# EAGLE design UD27C (EAGLE 6.4)
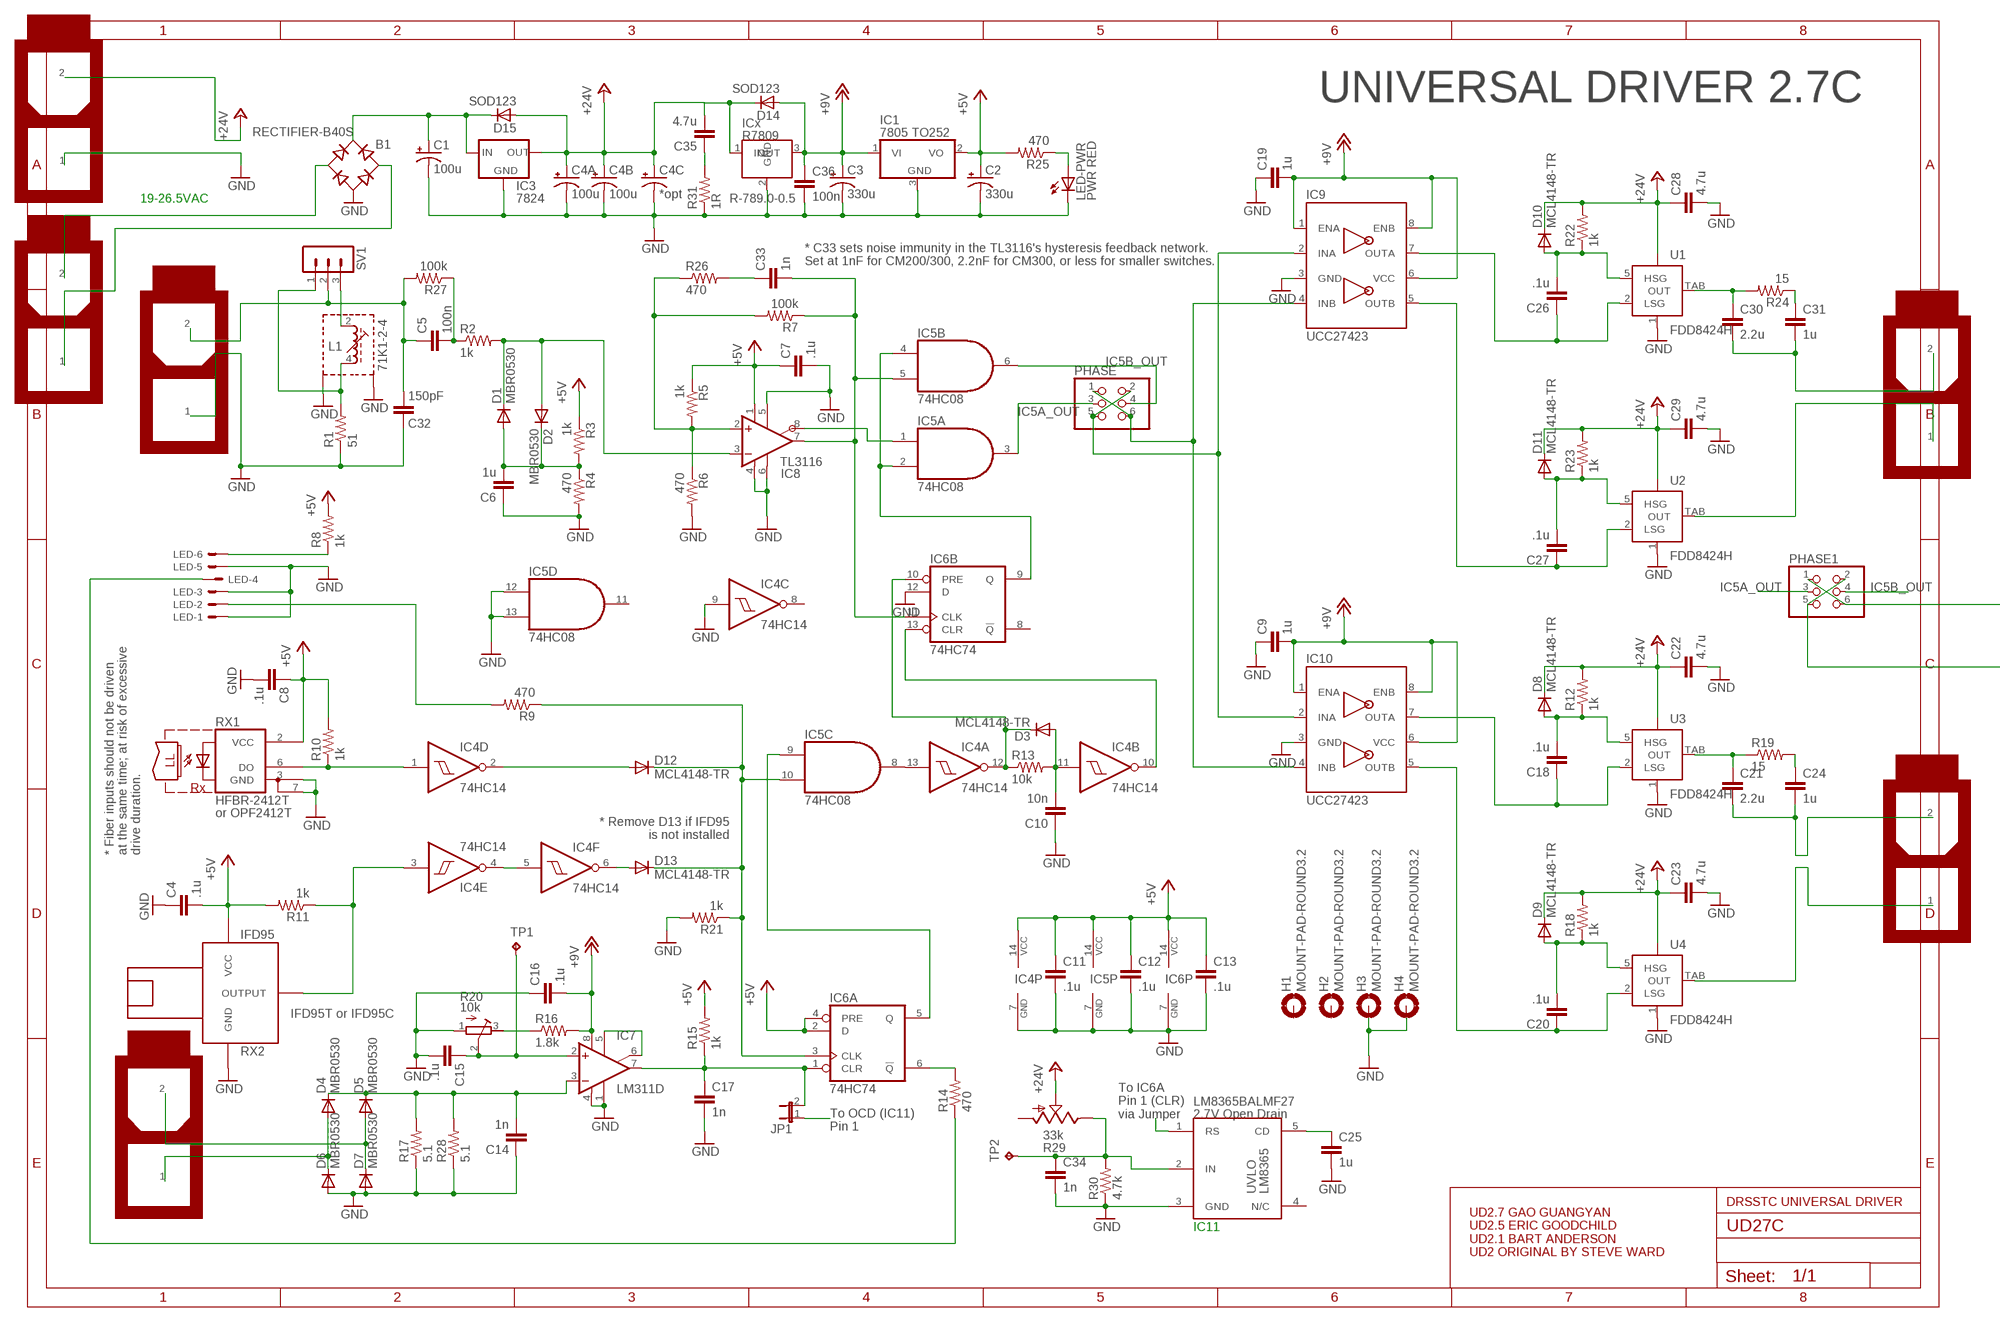
[diagram p0: schematic, sheet 1, part 1 of 2]
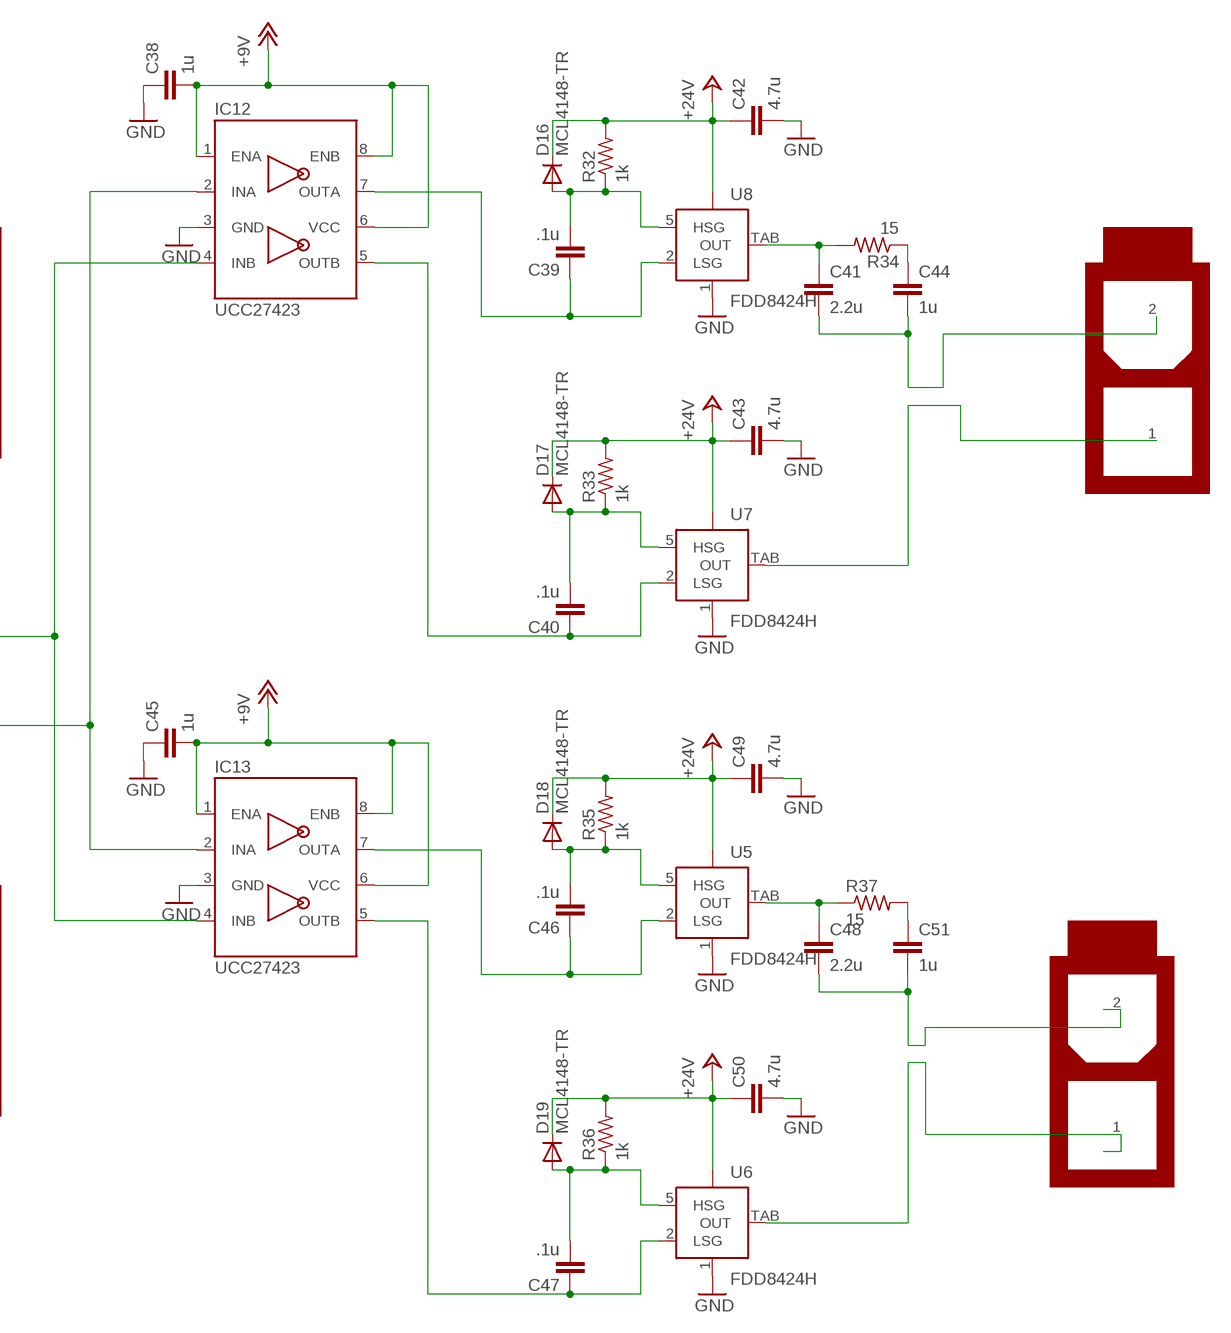
[diagram p1: schematic, sheet 1, part 2 of 2]

## Parts
B1  RECTIFIER-B40S  [B40S]
C1  100u  CPOL-USE3.5-8  [E3,5-8]
C2  330u  CPOL-USE3.5-8  [E3,5-8]
C3  330u  CPOL-USE3.5-8  [E3,5-8]
C4  .1u  C-EUC0805  [C0805]
C4A  100u  CPOL-USE3.5-8  [E3,5-8]
C4B  100u  CPOL-USE3.5-8  [E3,5-8]
C4C  *opt  CPOL-USE3.5-8  [E3,5-8]
C5  100n  C-EUC0805  [C0805]
C6  1u  C-EUC0805  [C0805]
C7  .1u  C-EUC0805  [C0805]
C8  .1u  C-EUC0805  [C0805]
C9  1u  C-EUC0805  [C0805]
C10  10n  C-EUC0805  [C0805]
C11  .1u  C-EUC0805  [C0805]
C12  .1u  C-EUC0805  [C0805]
C13  .1u  C-EUC0805  [C0805]
C14  1n  C-EUC0805  [C0805]
C15  .1u  C-EUC0805  [C0805]
C16  .1u  C-EUC0805  [C0805]
C17  1n  C-EUC0805  [C0805]
C18  .1u  C-EUC0805  [C0805]
C19  1u  C-EUC0805  [C0805]
C20  .1u  C-EUC0805  [C0805]
C21  2.2u  C-EUC1210  [C1210]
C22  4.7u  C-EUC1206  [C1206]
C23  4.7u  C-EUC1206  [C1206]
C24  1u  C-EUC1206  [C1206]
C25  1u  C-EUC0805  [C0805]
C26  .1u  C-EUC0805  [C0805]
C27  .1u  C-EUC0805  [C0805]
C28  4.7u  C-EUC1206  [C1206]
C29  4.7u  C-EUC1206  [C1206]
C30  2.2u  C-EUC1210  [C1210]
C31  1u  C-EUC1206  [C1206]
C32  150pF  C-EUC0805  [C0805]
C33  1n  C-EUC1206  [C1206]
C34  1n  C-EUC0805  [C0805]
C35  4.7u  C-EUC1206K  [C1206K]
C36  100n  C-EUC0805  [C0805]
C38  1u  C-EUC0805  [C0805]
C39  .1u  C-EUC0805  [C0805]
C40  .1u  C-EUC0805  [C0805]
C41  2.2u  C-EUC1210  [C1210]
C42  4.7u  C-EUC1206  [C1206]
C43  4.7u  C-EUC1206  [C1206]
C44  1u  C-EUC1206  [C1206]
C45  1u  C-EUC0805  [C0805]
C46  .1u  C-EUC0805  [C0805]
C47  .1u  C-EUC0805  [C0805]
C48  2.2u  C-EUC1210  [C1210]
C49  4.7u  C-EUC1206  [C1206]
C50  4.7u  C-EUC1206  [C1206]
C51  1u  C-EUC1206  [C1206]
D1  MBR0530  1N4148  [SOD323-W]
D2  MBR0530  1N4148  [SOD323-W]
D3  MCL4148-TR  1N4148  [SOD323-W]
D4  MBR0530  1N4148  [SOD323-W]
D5  MBR0530  1N4148  [SOD323-W]
D6  MBR0530  1N4148  [SOD323-W]
D7  MBR0530  1N4148  [SOD323-W]
D8  MCL4148-TR  1N4148  [SOD323-W]
D9  MCL4148-TR  1N4148  [SOD323-W]
D10  MCL4148-TR  1N4148  [SOD323-W]
D11  MCL4148-TR  1N4148  [SOD323-W]
D12  MCL4148-TR  1N4148  [SOD323-W]
D13  MCL4148-TR  1N4148  [SOD323-W]
D14  SOD123  D-SOD123  [SOD123]
D15  SOD123  D-SOD123  [SOD123]
D16  MCL4148-TR  1N4148  [SOD323-W]
D17  MCL4148-TR  1N4148  [SOD323-W]
D18  MCL4148-TR  1N4148  [SOD323-W]
D19  MCL4148-TR  1N4148  [SOD323-W]
H1  MOUNT-PAD-ROUND3.2  [3,2-PAD]
H2  MOUNT-PAD-ROUND3.2  [3,2-PAD]
H3  MOUNT-PAD-ROUND3.2  [3,2-PAD]
H4  MOUNT-PAD-ROUND3.2  [3,2-PAD]
IC1  7805 TO252  7805DT  [TO252]
IC2  R78XX  [TO220S]
IC3  7824  78XXD2PAK  [D2PACK]
IC4  74HC14  7414D  [SO14]
IC5  74HC08  74ALS08D  [SO14]
IC6  74HC74  74LS74D  [SO14]
IC7  LM311D  [SO08]
IC8  TL3116  [SO08]
IC9  UCC27423  [SO08]
IC10  UCC27423  [SO08]
IC11  LM8365  [SOT25]
IC12  UCC27423  [SO08]
IC13  UCC27423  [SO08]
JP1  JP1E  [JP1]
L1  71K1-2-4  [71K]
LED  22-23-2061  [22-23-2061]
LED-PWR  PWR RED  LEDCHIP-LED0805  [CHIP-LED0805]
PHASE  PINHD-2X3  [2X03]
PHASE1  PINHD-2X3  [2X03]
R1  51  R-US_0411/15  [0411/15]
R2  1k  R-US_M0805  [M0805]
R3  1k  R-US_M0805  [M0805]
R4  470  R-US_M0805  [M0805]
R5  1k  R-US_M0805  [M0805]
R6  470  R-US_M0805  [M0805]
R7  100k  R-US_M0805  [M0805]
R8  1k  R-US_R0805  [R0805]
R9  470  R-US_R0805  [R0805]
R10  1k  R-US_R0805  [R0805]
R11  1k  R-US_R0805  [R0805]
R12  1k  R-US_M0805  [M0805]
R13  10k  R-US_R0805  [R0805]
R14  470  R-US_R0805  [R0805]
R15  1k  R-US_R0805  [R0805]
R16  1.8k  R-US_R0805  [R0805]
R17  5.1  R-US_0309/12  [0309/12]
R18  1k  R-US_R0805  [R0805]
R19  15  R-US_R1210W  [R1210W]
R20  10k  R-TRIMM3296W  [RTRIM3296W]
R21  1k  R-US_R0805  [R0805]
R22  1k  R-US_M0805  [M0805]
R23  1k  R-US_R0805  [R0805]
R24  15  R-US_R1210W  [R1210W]
R25  470  R-US_M0805  [M0805]
R26  470  R-US_M0805  [M0805]
R27  100k  R-US_M0805  [M0805]
R28  5.1  R-US_0309/12  [0309/12]
R29  33k  TRIM_US-3223J  [3223J]
R30  4.7k  R-US_R0805  [R0805]
R31  1R  R-US_M0805  [M0805]
R32  1k  R-US_M0805  [M0805]
R33  1k  R-US_R0805  [R0805]
R34  15  R-US_R1210W  [R1210W]
R35  1k  R-US_M0805  [M0805]
R36  1k  R-US_R0805  [R0805]
R37  15  R-US_R1210W  [R1210W]
RX1  HFBR-2412T  [HFBR-X41XT]
RX2  IFD95  [OPTO-RECEIVER]
SV1  MA03-1  [MA03-1]
TP1  TPTP16R  [TP16R]
TP2  TPB1,27  [B1,27]
U1  FDD8424H  GGY_FDD8424H  [GGY_TO252_5]
U2  FDD8424H  GGY_FDD8424H  [GGY_TO252_5]
U3  FDD8424H  GGY_FDD8424H  [GGY_TO252_5]
U4  FDD8424H  GGY_FDD8424H  [GGY_TO252_5]
U5  FDD8424H  GGY_FDD8424H  [GGY_TO252_5]
U6  FDD8424H  GGY_FDD8424H  [GGY_TO252_5]
U7  FDD8424H  GGY_FDD8424H  [GGY_TO252_5]
U8  FDD8424H  GGY_FDD8424H  [GGY_TO252_5]
U$1  5566-2NP  [5566-2NP]
U$2  5566-2NP  [5566-2NP]
U$3  5566-2NP  [5566-2NP]
U$4  5566-2NP  [5566-2NP]
U$5  5566-2NP  [5566-2NP]
U$6  5566-2NP  [5566-2NP]
U$7  5566-2NP  [5566-2NP]
U$8  5566-2NP  [5566-2NP]

## Nets
+5V: C2.+ C4.2 C7.1 C8.1 C11.1 C12.1 C13.1 IC1.2(VO) IC4.14(P:VCC) IC5.14(P:VCC) IC6.2(A:D) IC6.4(A:PRE) IC6.14(P:VCC) IC8.1(V+) R3.1 R5.1 R8.2 R10.2 R11.2 R15.2 R25.2 RX1.2(VCC) RX2.P$3(VCC)
+12V: C3.+ C9.2 C16.2 C19.2 C36.1 C38.2 C45.2 D14.2(A) IC1.1(VI) IC2.3(OUT) IC7.8(V+) IC9.1(ENA) IC9.6(VCC) IC9.8(ENB) IC10.1(ENA) IC10.6(VCC) IC10.8(ENB) IC12.1(ENA) IC12.6(VCC) IC12.8(ENB) IC13.1(ENA) IC13.6(VCC) IC13.8(ENB) R16.2 ; supply symbol labelled +9V
+24V: C4A.+ C4B.+ C4C.+ C22.1 C23.1 C28.1 C29.1 C35.2 C42.1 C43.1 C49.1 C50.1 D8.C D9.C D10.C D11.C D14.1(C) D15.2(A) D16.C D17.C D18.C D19.C IC2.1(IN) IC3.3(OUT) R12.2 R18.2 R22.2 R23.2 R29.2(S) R32.2 R33.2 R35.2 R36.2 U1.4(VBB) U2.4(VBB) U3.4(VBB) U4.4(VBB) U5.4(VBB) U6.4(VBB) U7.4(VBB) U8.4(VBB) U$1.2(PCIE-2)
GND: B1.- C1.- C2.- C3.- C4.1 C4A.- C4B.- C4C.- C6.1 C7.2 C8.2 C9.1 C10.1 C11.2 C12.2 C13.2 C14.1 C15.2 C16.1 C17.2 C19.1 C22.2 C23.2 C25.2 C28.2 C29.2 C32.1 C34.2 C36.2 C38.1 C42.2 C43.2 C45.1 C49.2 C50.2 D6.A D7.A H3.B3,2(MOUNT) H4.B3,2(MOUNT) IC1.3(GND) IC2.2(GND) IC3.2(GND) IC4.7(P:GND) IC4.9(C:I) IC5.7(P:GND) IC5.12(D:I0) IC5.13(D:I1) IC6.7(P:GND) IC6.12(B:D) IC7.1(GND) IC7.4(V-) IC8.4(V-) IC8.5(LATCH) IC8.6(GND) IC9.3(GND) IC10.3(GND) IC11.3(GND) IC12.3(GND) IC13.3(GND) L1.S1 L1.S2 LED-PWR.C LED.1 LED.3 LED.5 R1.1 R4.2 R6.2 R17.1 R20.1(E) R21.2 R28.1 R30.1 R31.1 RX1.3(GND) RX1.7(GND1) RX2.P$1(GND) U1.1(GND) U2.1(GND) U3.1(GND) U4.1(GND) U5.1(GND) U6.1(GND) U7.1(GND) U8.1(GND) U$1.1(PCIE-1) U$7.1(PCIE-1)
IC5A_OUT: IC5.3(A:O) PHASE1.3 PHASE.3
IC5B_OUT: IC5.6(B:O) PHASE1.4 PHASE.4
N$1: IC12.4(INB) IC13.4(INB) PHASE1.1 PHASE1.6
N$2: L1.4(E) R1.2 SV1.1
N$3: IC4.1(D:I) R10.1 RX1.6(DO)
N$4: R16.1 R20.3(A)
N$5: B1.+ C1.+ D15.1(C) IC3.1(IN)
N$6: C33.1 R26.2
N$7: LED-PWR.A R25.1
N$8: C5.1 C32.2 R27.2 SV1.2 U$7.2(PCIE-2)
N$9: L1.2(A) SV1.3
N$10: B1.AC1 U$2.2(PCIE-2)
N$11: D12.A IC4.2(D:O)
N$12: D12.C D13.C IC5.10(C:I1) IC6.3(A:CLK) R9.1 R21.1
N$13: D13.A IC4.6(F:O)
N$14: IC4.4(E:O) IC4.5(F:I)
N$15: C18.1 IC10.7(OUTA) U3.2(LSG)
N$17: IC4.3(E:I) R11.1 RX2.P$2(OUTPUT)
N$18: C18.2 D8.A R12.1 U3.5(HSG)
N$19: C21.1 R19.1 U3.TAB(OUT)
N$20: C20.1 IC10.5(OUTB) U4.2(LSG)
N$21: C20.2 D9.A R18.1 U4.5(HSG)
N$22: U4.TAB(OUT) U$3.1(PCIE-1)
N$23: IC9.4(INB) IC10.4(INB) PHASE.1 PHASE.6
N$24: C24.1 R19.2
N$25: IC9.2(INA) IC10.2(INA) PHASE.2 PHASE.5
N$26: C31.1 R24.1
N$27: C30.2 C31.2 U$4.2(PCIE-2)
N$28: C39.1 IC12.7(OUTA) U8.2(LSG)
N$29: C21.2 C24.2 U$3.2(PCIE-2)
N$30: C25.1 IC11.5(CD)
N$31: IC11.1(RS) JP1.1
N$32: C34.1 IC11.2(IN) R29.3(E) R30.2 TP2.TP
N$33: C39.2 D16.A R32.1 U8.5(HSG)
N$34: C35.1 R31.2
N$35: C41.1 R34.2 U8.TAB(OUT)
N$36: C40.1 IC12.5(OUTB) U7.2(LSG)
N$37: C40.2 D17.A R33.1 U7.5(HSG)
N$38: U7.TAB(OUT) U$5.1(PCIE-1)
N$39: C46.1 IC13.7(OUTA) U5.2(LSG)
N$40: C46.2 D18.A R35.1 U5.5(HSG)
N$41: IC5.2(A:I1) IC5.4(B:I0) IC6.9(B:Q)
N$42: C48.1 R37.1 U5.TAB(OUT)
N$43: C47.1 IC13.5(OUTB) U6.2(LSG)
N$44: C47.2 D19.A R36.1 U6.5(HSG)
N$45: U6.TAB(OUT) U$6.1(PCIE-1)
N$47: IC12.2(INA) IC13.2(INA) PHASE1.2 PHASE1.5
N$48: C41.2 C44.2 U$5.2(PCIE-2)
N$49: C48.2 C51.2 U$6.2(PCIE-2)
N$50: C44.1 R34.1
N$51: C51.1 R37.2
N$53: C17.1 IC6.1(A:CLR) IC7.7(OUT) JP1.2 R15.1
N$54: D3.C IC4.12(A:O) IC6.10(B:PRE) R13.1
N$57: C10.2 D3.A IC4.11(B:I) R13.2
N$58: IC4.10(B:O) IC6.13(B:CLR)
N$59: IC7.5(ON) IC7.6(ON/STR)
N$60: C15.1 IC7.2(+IN) R20.2(S) TP1.TP
N$61: C14.2 D4.C D5.C IC7.3(-IN) R17.2 R28.2
N$69: B1.AC2 U$2.1(PCIE-1)
N$71: D5.A D7.C U$8.2(PCIE-2)
N$72: D4.A D6.C U$8.1(PCIE-1)
N$74: IC4.13(A:I) IC5.8(C:O)
N$76: IC6.6(A:!Q) R14.2
N$77: C33.2 IC5.5(B:I1) IC6.11(B:CLK) IC8.7(Q) R7.1
N$78: IC8.2(+IN) R5.2 R6.1 R7.2 R26.1
N$80: C5.2 R2.1 R27.1
N$81: D1.C D2.A IC8.3(-IN) R2.2
N$82: C6.2 D1.A D2.C R3.2 R4.1
N$90: IC5.1(A:I0) IC8.8(QNOT)
N$93: IC5.9(C:I0) IC6.5(A:Q)
N$94: C26.1 IC9.7(OUTA) U1.2(LSG)
N$95: C26.2 D10.A R22.1 U1.5(HSG)
N$96: C30.1 R24.2 U1.TAB(OUT)
N$97: C27.1 IC9.5(OUTB) U2.2(LSG)
N$98: C27.2 D11.A R23.1 U2.5(HSG)
N$99: U2.TAB(OUT) U$4.1(PCIE-1)
N$102: LED.6 R8.1
N$103: LED.4 R14.1
N$104: LED.2 R9.2
Unconnected: H1.B3,2(MOUNT) H2.B3,2(MOUNT) IC4.8(C:O) IC5.11(D:O) IC6.8(B:!Q) IC11.4(N/C) R29.1(A)

## Notes on the sheet
- UNIVERSAL DRIVER 2.7C
- 19-26.5VAC | R-789.0-0.5
- * C33 sets noise immunity in the TL3116's hysteresis feedback network.
  Set at 1nF for CM200/300, 2.2nF for CM300, or less for smaller switches.
- or OPF2412T
- * Remove D13 if IFD95
  is not installed
- * Fiber inputs should not be driven
  at the same time; at risk of excessive
  drive duration.
- IFD95T or IFD95C
- LM8365BALMF27
- To IC6A
  Pin 1 (CLR)
  via Jumper
- 2.7V Open Drain
- To OCD (IC11)
  Pin 1
- DRSSTC UNIVERSAL DRIVER
- IC11
- UD2.7 GAO GUANGYAN
  UD2.5 ERIC GOODCHILD
  UD2.1 BART ANDERSON
  UD2 ORIGINAL BY STEVE WARD

## Library data of the parts
B1 = rectifier:RECTIFIER-: Rectifier
C1-C3 C4A C4B C4C = rcl:CPOL-US: POLARIZED CAPACITOR, American symbol
C4-C36 C38-C51 = rcl:C-EU: CAPACITOR, European symbol
D1-D13 D16-D19 = diode:1N4148: DIODE high speed (Philips)
D14 D15 = semicon-smd-ipc:D-: DIODE unfilled
H1-H4 = holes:MOUNT-PAD-ROUND: MOUNTING PAD, round
IC1 = linear:78*: Positive VOLTAGE REGULATOR Source: http://cache.national.com/ds/LM/LM78L05.pdf http://www.fairchildsemi.com/ds/LM/LM7805.pdf
IC2 = UD 2_7_revA:R78XX
IC3 = qcwBuck:78XXD2PAK: VOLTAGE REGULATOR
IC4 = 74xx-us:74*14: Hex schmitt trigger INVERTER
IC5 = 74xx-us:74*08: Quad 2-input AND gate
IC6 = 74xx-us:74*74: Dual D type positive edge triggered FLIP FLOP, preset and clear
IC7 = linear:LM311: COMPARATOR
IC8 = UD27:TL3116
IC9 IC10 IC12 IC13 = UD27:UCC27423
IC11 = UD 2_7_revA:LM8365
JP1 = jumper:JP1E: JUMPER
L1 = UD27:71K1-: FILTER adjustable filter coil, type K; OC_FARNELL: unknown; OC_NEWARK: unknown
LED = con-molex:22-23-2061: .100" (2.54mm) Center Header - 6 Pin; MF: MOLEX; MPN: 22-23-2061; OC_FARNELL: 1462922; OC_NEWARK: 27C1933
LED-PWR = led:LED: LED OSRAM: - CHIPLED LG R971, LG N971, LY N971, LG Q971, LY Q971, LO R971, LY R971 LH N974, LH R974 LS Q976, LO Q976, LY Q976 LO Q996 - Hyper CHIPLED LW Q18S LB Q993, LB Q99A, LB R99A - SideLED LS A670, LO A670, LY A670, LG A670, LP A670 LB A673, LV A673, LT A673, LW A673 LH A674 LY A675 LS A676, LA A676, LO A676, LY A676, LW A676 LS A679, LY A679, LG A679 - Hyper Micro SIDELED� LS Y876, LA Y876, LO Y876, LY Y876 LT Y87S - SmartLED LW L88C, LW L88S LB L89C, LB L89S, LG L890 LS L89K, LO L89K, LY L89K LS L896, LA L896, LO L896, LY L896 - TOPLED LS T670, LO T670, LY T670, LG T670, LP T670 LSG T670, LSP T670, LSY T670, LOP T670, LYG T670 LG T671, LOG T671, LSG T671 LB T673, LV T673, LT T673, LW T673 LH T674 LS T676, LA T676, LO T676, LY T676, LB T676, LH T676, LSB T676, LW T676 LB T67C, LV T67C, LT T67C, LS T67K, LO T67K, LY T67K, LW E67C LS E67B, LA E67B, LO E67B, LY E67B, LB E67C, LV E67C, LT E67C LW T67C LS T679, LY T679, LG T679 LS T770, LO T770, LY T770, LG T770, LP T770 LB T773, LV T773, LT T773, LW T773 LH T774 LS E675, LA E675, LY E675, LS T675 LS T776, LA T776, LO T776, LY T776, LB T776 LHGB T686 LT T68C, LB T68C - Hyper Mini TOPLED� LB M676 - Mini TOPLED Santana� LG M470 LS M47K, LO M47K, LY M47K Source: http://www.osram.convergy.de LUXEON: - LUMILED� LXK2-PW12-R00, LXK2-PW12-S00, LXK2-PW14-U00, LXK2-PW14-V00 LXK2-PM12-R00, LXK2-PM12-S00, LXK2-PM14-U00 LXK2-PE12-Q00, LXK2-PE12-R00, LXK2-PE12-S00, LXK2-PE14-T00, LXK2-PE14-U00 LXK2-PB12-K00, LXK2-PB12-L00, LXK2-PB12-M00, LXK2-PB14-N00, LXK2-PB14-P00, LXK2-PB14-Q00 LXK2-PR12-L00, LXK2-PR12-M00, LXK2-PR14-Q00, LXK2-PR14-R00 LXK2-PD12-Q00, LXK2-PD12-R00, LXK2-PD12-S00 LXK2-PH12-R00, LXK2-PH12-S00 LXK2-PL12-P00, LXK2-PL12-Q00, LXK2-PL12-R00 Source: www.luxeon.com KINGBRIGHT: KA-3528ASYC Source: www.kingbright.com
PHASE PHASE1 = pinhead:PINHD-2X3: PIN HEADER
R1-R19 R21-R28 R30-R37 = rcl:R-US_: RESISTOR, American symbol
R20 = rcl:R-TRIMM: Trimm resistor
R29 = pot:TRIM_US-: POTENTIOMETER
RX1 = fiber-optic-hp:HFBR-2412T: RECEIVER low cost miniature fiber optic component, ST housed, TX standard power; MF: AGILENT TECHNOLOGIES; MPN: HFBR-2412T; OC_FARNELL: 1247650; OC_NEWARK: 06F6075
RX2 = BillPorter:IFD95: IF-D95T Photologic Detector with Totem-Pole Output. Fiber Optic Receiver with push-pull output. May also work with IF-D97 and IF-D98 receivers. Spec sheet @ http://www.i-fiberoptics.com/pdf/IFD95.pdf
SV1 = con-lstb:MA03-1: PIN HEADER; OC_FARNELL: unknown; OC_NEWARK: unknown
TP1 TP2 = testpad:TP: Test pad
U1-U8 = UD27worked:GGY_FDD8424H
U$1-U$8 = LEDparts:5566-2NP

## Board
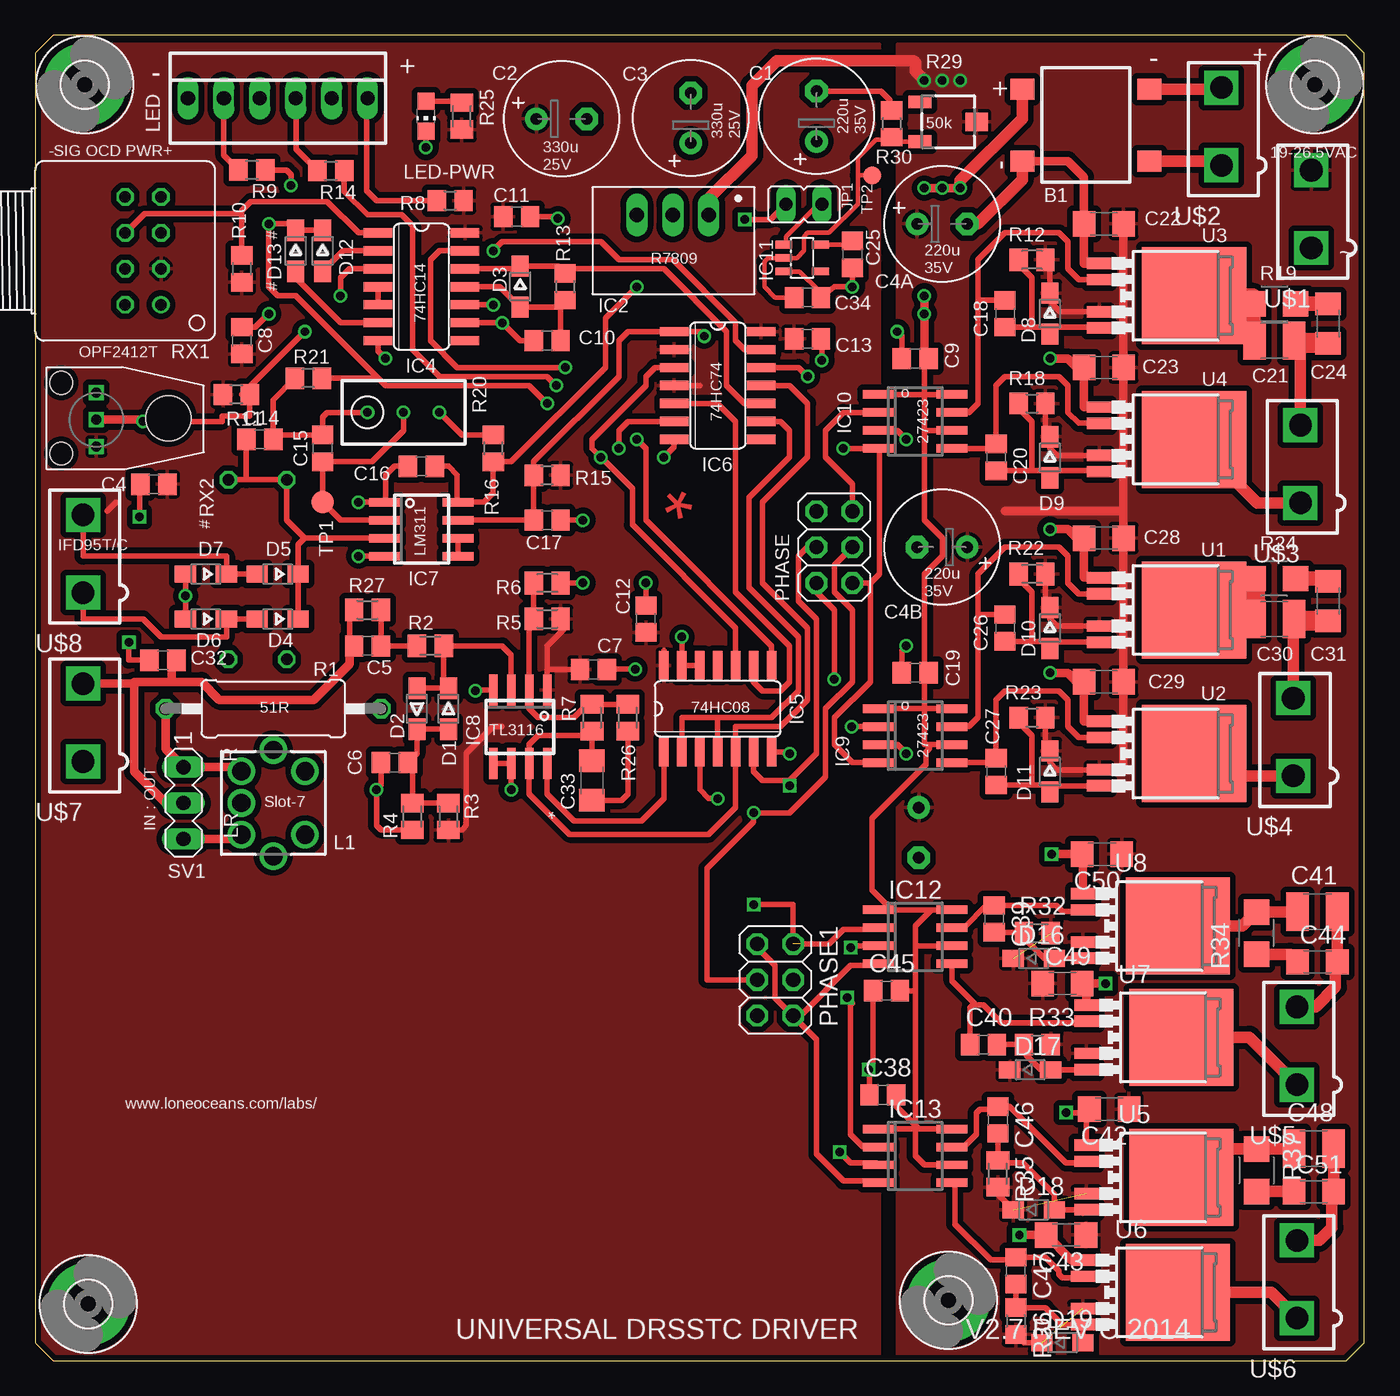
[diagram p2: board, top side]
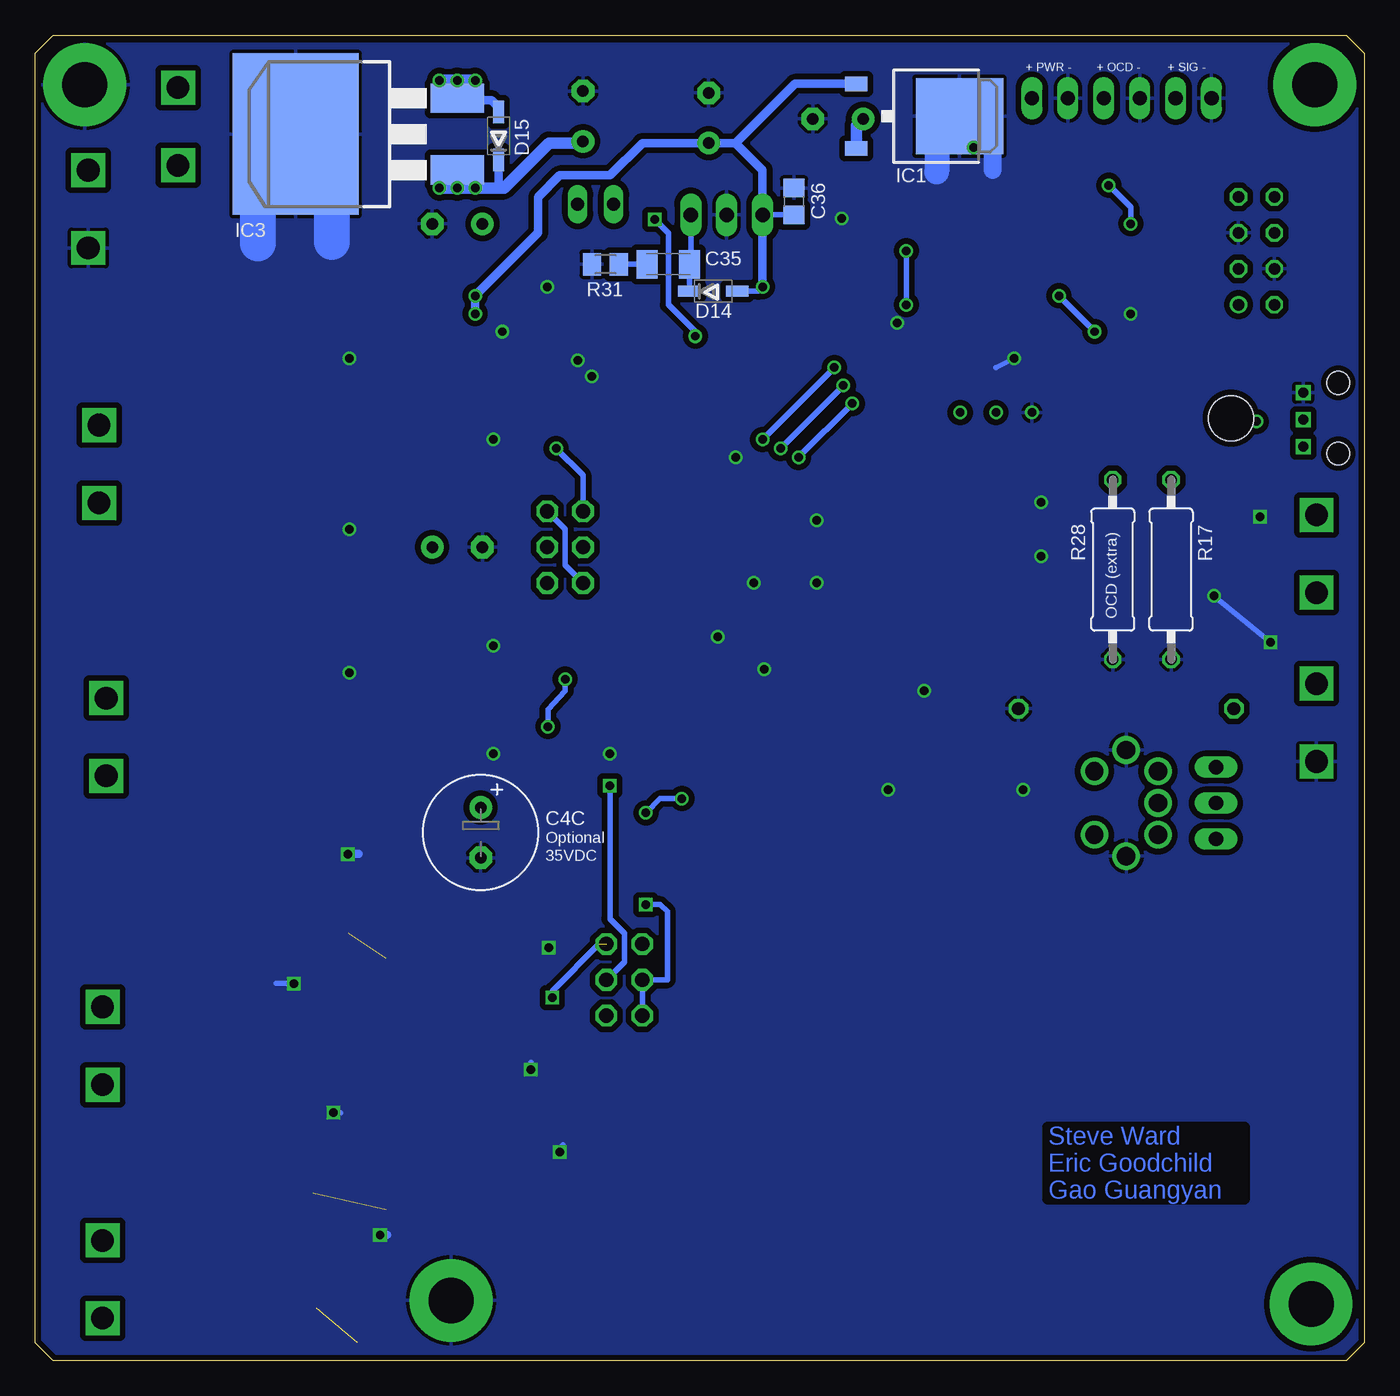
[diagram p3: board, bottom side, seen from below]

Size 93.98 x 93.73 mm. Coordinates in mm from the lower left corner, seen from the top.
Outline: 1.27,0 92.71,0 93.98,1.27 93.98,92.46 92.71,93.73 1.27,93.73 0,92.46 0,1.27 1.27,0
Copper layers (1*16): Top 0.0356mm / dielectric 1.5011mm / Bottom 0.0356mm
Design rules "LaenPCBOrder": minimum track width 6mil, minimum drill 13mil, track to track 6mil, track to pad 6mil, pad to pad 6mil, via to via 6mil, smd to smd 6mil, copper to edge 15mil, drill to drill 6mil, minimum pad ring 7mil, minimum via ring 7mil, stop-mask expansion 3mil, vias tented up to drill 0mil, thermal gap 10mil

### Footprints (pad centres in the part's own frame; a part is rotated, then mirrored left to right if it is on the bottom)
B40S = smd 1.5 x 1.7: + -2.55,-4.5; - 2.55,-4.5; AC1 -2.55,4.5; AC2 2.55,4.5
E3,5-8 = drill 0.813 pad 1.6: + -1.778,0 | drill 0.813 pad 1.6 octagon: - 1.778,0
C0805 = smd 1.3 x 1.5: 1 -0.95,0; 2 0.95,0
C1210 = smd 1.6 x 2.7: 1 -1.4,0; 2 1.4,0
C1206 = smd 1.6 x 1.8: 1 -1.4,0; 2 1.4,0
C1206K = smd 1.5 x 2: 1 -1.5,0; 2 1.5,0
SOD323-W = smd 1.5 x 1.2: A 1.45,0; C -1.45,0
SOD123 = smd 1.6 x 0.8: 1 -1.7,0; 2 1.7,0
3,2-PAD = drill 3.2 pad 5.842: B3,2 0,0
TO252 = smd 1 x 1.6: 1 -2.28,-4.8; 2 2.28,-4.8 | smd 5.4 x 6.2: 3 0,2.5
TO220S = drill 1.016 long: 1 -2.54,-2.54; 2 0,-2.54; 3 2.54,-2.54
D2PACK = smd 2.083 x 3.81: 1 -2.54,-8.89; 3 2.54,-8.89 | smd 11.43 x 8.89: 2 0,2.54
SO14 = smd 0.66 x 2.032: 1 -3.81,-3.073; 2 -2.54,-3.073; 3 -1.27,-3.073; 4 0,-3.073; 5 1.27,-3.073; 6 2.54,-3.073; 7 3.81,-3.073; 8 3.81,3.073; 9 2.54,3.073; 10 1.27,3.073; 11 0,3.073; 12 -1.27,3.073; 13 -2.54,3.073; 14 -3.81,3.073
SO08 = smd 0.6 x 2.2: 1 -1.905,-2.6; 2 -0.635,-2.6; 3 0.635,-2.6; 4 1.905,-2.6; 5 1.905,2.6; 6 0.635,2.6; 7 -0.635,2.6; 8 -1.905,2.6
SOT25 = smd 0.55 x 1.2: 1 -0.95,-1.3; 2 0,-1.3; 3 0.95,-1.3; 4 0.95,1.3; 5 -0.95,1.3
JP1 = drill 0.914 long: 1 0,-1.27; 2 0,1.27
71K = drill 1.3: 1 -2.25,-2.25; 2 -2.25,2.25; 3 0,2.25; 4 2.25,2.25; 5 2.25,-2.25; S1 -3.75,0; S2 3.75,0
22-23-2061 = drill 1 long: 1 -6.35,0; 2 -3.81,0; 3 -1.27,0; 4 1.27,0; 5 3.81,0; 6 6.35,0
CHIP-LED0805 = smd 1.2 x 1.2: A 0,-1.05; C 0,1.05
2X03 = drill 1.016 octagon: 1 -2.54,-1.27; 2 -2.54,1.27; 3 0,-1.27; 4 0,1.27; 5 2.54,-1.27; 6 2.54,1.27
0411/15 = drill 0.914 octagon: 1 -7.62,0; 2 7.62,0
M0805 = smd 1.3 x 1.6: 1 -0.95,0; 2 0.95,0
R0805 = smd 1.3 x 1.5: 1 -0.95,0; 2 0.95,0
0309/12 = drill 0.813 octagon: 1 -6.35,0; 2 6.35,0
R1210W = smd 1.8 x 1.8: 1 -1.499,0; 2 1.499,0
RTRIM3296W = drill 0.61: 1 0,-2.54; 2 0,0; 3 0,2.54
3223J = smd 1.6 x 0.9: 1 -2,1.4; 3 -2,-1.4 | smd 1.6 x 1.3: 2 2,0
HFBR-X41XT = drill 0.813: 1 3.81,2.54 | drill 0.813 octagon: 2 1.27,2.54; 3 -1.27,2.54; 4 -3.81,2.54; 5 -3.81,0; 6 -1.27,0; 7 1.27,0; 8 3.81,0
OPTO-RECEIVER = drill 0.7 square: P$1 1.9,0; P$2 0,0; P$3 -1.9,0 | hole 1.6: -2.4,2.5; 2.6,2.5 | hole 3.2: 0.1,-5.1
MA03-1 = drill 1.016 long: 1 -2.54,0; 2 0,0; 3 2.54,0
TP16R = smd 1.6 x 1.6: TP 0,0
B1,27 = smd 1.27 x 1.27: TP 0,0
GGY_TO252_5 = smd 0.8 x 1.727: 1 -2.28,-5.41; 2 -1.14,-5.41; 4 1.14,-5.41; 5 2.28,-5.41 | smd 6.858 x 7.366: TAB 0,1.3
5566-2NP = drill 1.6 square: 1 2.1,-3.35; 2 2.1,2.15

### Placement (x,y rotation side)
B1  74.3,87.38 270 top
C1  55.24,88.01 90 top
C2  37.21,87.82 0 top
C3  46.35,87.88 90 top
C4  8.38,61.98 0 top
C4A  64.14,80.39 0 top
C4B  64.14,57.53 180 top
C4C  62.48,37.34 270 bottom
C5  23.5,50.55 0 top
C6  25.4,42.29 0 top
C7  39.47,48.87 0 top
C8  14.61,72.14 90 top
C9  62.23,70.87 0 top
C10  36.2,72.14 0 top
C11  34.04,80.9 0 top
C12  43.18,52.45 90 top
C13  54.61,72.26 0 top
C14  15.88,65.15 180 top
C15  20.32,64.52 90 top
C16  27.3,63.25 0 top
C17  36.2,59.44 0 top
C18  68.58,74.04 270 top
C19  62.23,48.64 0 top
C20  67.94,63.88 270 top
C21  87.63,72.14 0 top
C22  75.56,80.39 180 top
C23  75.56,70.23 180 top
C24  91.44,73.34 270 top
C25  57.78,78.23 270 top
C26  68.58,51.82 270 top
C27  67.94,41.66 270 top
C28  75.56,58.17 180 top
C29  75.56,48.01 180 top
C30  87.63,52.45 0 top
C31  91.44,53.72 270 top
C32  9.02,49.53 0 top
C33  39.37,41.02 90 top
C34  54.61,75.18 0 top
C35  49.21,77.53 0 bottom
C36  40.32,81.98 90 bottom
C38  59.94,18.8 0 top
C39  67.82,31.24 270 top
C40  67.06,22.35 0 top
C41  90.68,31.75 0 top
C42  75.95,17.78 180 top
C43  72.9,8.89 180 top
C44  90.68,28.19 0 top
C45  60.2,26.16 0 top
C46  68.07,17.02 270 top
C47  69.34,6.35 270 top
C48  90.42,14.99 0 top
C49  72.64,26.67 0 top
C50  75.44,35.81 180 top
C51  90.42,11.94 0 top
D1  29.21,46.1 270 top
D2  26.99,46.1 90 top
D3  34.29,75.95 270 top
D4  17.14,52.45 180 top
D5  17.14,55.63 180 top
D6  12.06,52.45 180 top
D7  12.06,55.63 180 top
D8  71.75,74.04 270 top
D9  71.75,63.88 270 top
D10  71.75,51.82 270 top
D11  71.75,41.66 270 top
D12  20.32,78.49 270 top
D13  18.41,78.49 270 top
D14  46.04,75.63 0 bottom
D15  61.21,86.61 90 bottom
D16  70.61,28.45 0 top
D17  70.36,20.57 0 top
D18  70.61,10.67 0 top
D19  72.64,1.27 0 top
H1  3.75,4 0 top
H2  3.49,90.23 0 top
H3  90.49,90.23 0 top
H4  64.58,4.25 0 top
IC1  31.11,88.01 270 bottom
IC2  45.09,78.49 180 top
IC3  73.03,86.74 90 bottom
IC4  27.3,75.95 270 top
IC5  48.26,46.1 0 top
IC6  48.26,68.96 270 top
IC7  27.3,58.8 270 top
IC8  34.29,44.83 180 top
IC9  62.23,44.2 270 top
IC10  62.23,66.42 270 top
IC11  54.23,77.98 270 top
IC12  62.23,29.97 270 top
IC13  62.23,14.48 270 top
JP1  54.36,81.79 90 top
L1  16.83,39.43 90 top
LED  17.14,89.28 0 top
LED-PWR  27.62,88.01 180 top
PHASE  56.52,57.53 90 top
PHASE1  52.32,26.92 270 top
R1  16.83,46.1 180 top
R2  27.94,50.55 0 top
R3  29.21,38.48 90 top
R4  26.67,38.48 270 top
R5  36.2,52.45 180 top
R6  36.2,54.99 0 top
R7  39.37,45.47 90 top
R8  29.34,82.04 0 top
R9  15.32,84.2 180 top
R10  14.61,77.22 270 top
R11  14.22,68.33 180 top
R12  70.48,77.85 0 top
R13  37.47,75.95 270 top
R14  20.9,84.15 0 top
R15  36.2,62.61 0 top
R16  32.38,64.52 270 top
R17  13.65,55.94 90 bottom
R18  70.48,67.69 0 top
R19  87.63,74.74 0 top
R20  26.04,67.06 270 top
R21  19.3,69.47 180 top
R22  70.48,55.63 0 top
R23  70.48,45.47 0 top
R24  87.63,55.31 180 top
R25  30.16,88.01 270 top
R26  41.91,45.47 270 top
R27  23.5,53.09 180 top
R28  17.78,55.94 90 bottom
R29  64.56,87.61 0 top
R30  60.56,87.48 270 top
R31  53.66,77.53 0 bottom
R32  70.87,30.23 0 top
R33  70.87,22.35 0 top
R34  86.36,30.23 90 top
R35  68.07,13.21 270 top
R36  69.34,2.79 270 top
R37  86.36,13.46 270 top
RX1  6.35,78.49 270 top
RX2  4.32,66.55 90 top
SV1  10.48,39.43 270 top
TP1  20.32,60.71 0 top
TP2  59.18,83.82 0 top
U1  80.64,53.09 270 top
U2  80.64,42.93 270 top
U3  80.64,75.31 270 top
U4  80.64,65.15 270 top
U5  79.76,12.95 270 top
U6  79.5,4.83 270 top
U7  79.76,22.86 270 top
U8  79.5,30.73 270 top
U$1  88.14,82.04 0 top
U$2  81.79,87.88 0 top
U$3  87.38,64.01 0 top
U$4  86.87,44.7 0 top
U$5  87.12,22.86 0 top
U$6  87.12,6.35 0 top
U$7  1.27,45.72 0 top
U$8  1.27,57.66 0 top

### Tracks (layer width: path | path; a pad name or v marks a point on that pad's centre or on a via)
+5V
  Top 0.406: 5.08,60.08 5.71,60.71 | 43.6,51.08 C12.1 43.5,51.82 | R15.2 37.47,62.93 | 46.99,68.96 IC6.4 | R5.1 37.47,52.13 37.47,51.82 36.2,50.55 IC8.1 36.2,48.87 C7.1 | R3.1 30.16,37.53 30.48,37.85 30.48,42.93 32.38,44.83 33.02,44.83 | 44.45,50.23 IC5.14 | IC4.14 30.35,79.76
  Bottom 0.813: IC1.2 35.91,87.34 C2.+
  pour Top (isolate 0.406): 0,-0.64 0,93.09 59.69,93.09 59.69,-0.64
+12V  (via drill 0.6)
  Top 0.406: 62.87,65.79 IC10.6 | 62.87,68.33 62.87,65.79 | 62.87,68.33 IC10.8 | C9.2 62.87,70.87 62.87,68.33 | 62.87,68.33 IC10.1 | 62.87,46.1 IC9.8 | 62.87,46.1 62.87,43.56 62.99,43.56 | 62.99,43.56 IC9.6 | 62.87,46.1 62.87,48.64 C19.2 62.87,48.96 62.87,55.63 64.14,56.9 64.14,58.17 62.87,59.44 62.87,65.79 | 62.87,46.1 IC9.1 | C16.2 29.21,63.25 29.84,62.61 29.84,60.77 IC7.8 31.75,60.71 32.38,61.34 R16.2 33.66,63.57 40.32,70.23 40.32,73.72 v42.55,75.95 | IC12.1 60.58,31.88 | IC12.8 63.37,31.88 | 63.37,31.88 62.23,30.73 62.23,29.21 | IC12.6 62.36,29.34 62.23,29.21 | IC13.1 62.23,16.38 | 62.23,16.38 62.48,16.38 | 62.48,16.38 IC13.8 | 62.23,29.21 62.23,26.16 | 62.23,26.16 62.23,16.38 | IC13.6 62.87,13.84 62.23,14.48 62.23,16.38 | 62.99,43.56 63.25,43.31 62.99,43.05 62.99,42.16 59.18,38.35 59.18,33.27 60.58,31.88 | C38.2 60.89,17.97 62.48,16.38 | C45.2 62.23,26.16 | 63.37,31.88 60.58,31.88
  Top 0.61: C9.2 62.87,71.18 v62.87,75.31
  Bottom 0.406: IC2.3 C36.1 | v42.55,75.95 42.86,75.63 D14.2
  Bottom 0.61: v42.55,75.95 IC2.3 42.55,84.2 44.45,86.11 | v62.87,75.31 62.87,74.99 | v62.87,74.04 v62.87,75.31 | 44.45,86.11 C3.+ 51.05,86.11 53.34,83.82 56.9,83.82 58.42,82.3 58.42,79.76 v62.87,75.31 | IC1.1 40.27,90.29 44.45,86.11
+24V  (via drill 0.6)  (3 unrouted)
  Top 0.406: R12.2 71.75,77.53 D8.C 71.93,74.71 | 71.93,74.71 71.94,74.68 | R18.2 71.44,65.65 D9.C 71.75,64.52 72.26,64.01 U4.4 | R22.2 71.44,53.59 D10.C 71.75,52.45 72.26,51.95 U1.4 | R23.2 71.44,43.43 D11.C 71.75,42.29 72.26,41.79 U2.4 | 71.93,74.71 72.47,74.17 U3.4 | D19.C 69.92,1.27 R36.2 | R35.2 68.07,11.76 D18.C
  Top 0.61: 77.47,80.52 C22.1 76.97,74.17 | 76.97,74.17 C23.1 76.97,64.01 | 76.97,60.07 C28.1 76.97,51.95 | 76.97,60.07 76.97,64.01 | 76.97,51.95 C29.1 76.97,41.79 U2.4 | 76.97,60.07 68.58,60.07 | U3.4 76.97,74.17 | U4.4 76.97,64.01 | U1.4 76.97,51.95
  Top 0.813: IC2.1 47.62,82.17 50.67,85.22 50.67,90.17 52.45,91.95 62.1,91.95 62.23,91.82 62.23,91.19 v62.87,90.55
  Bottom 0.406: IC2.1 47.62,77.62 C35.2 47.71,75.97 D14.1
  Bottom 0.61: D15.2 61.21,88.65 61.72,89.15 64.01,89.15 IC3.3
  Bottom 0.813: v65.41,90.55 v64.14,90.55 | v62.87,90.55 v64.14,90.55 | v64.14,90.55 IC3.3
  pour Top (isolate 0.406): 93.98,-0.64 60.96,-0.64 60.96,93.09 93.98,93.09
GND  (via drill 0.6)
  Top 0.305: IC11.3 54.04,77.03 55.37,75.69 55.37,75.37 C34.2
  Top 0.406: IC10.3 60.96,65.79 v61.59,65.15 | IC9.3 60.96,43.56 v61.59,42.93 | C9.1 61.28,72.46 v60.96,72.77 | C19.1 61.28,50.23 v61.59,50.55 | 17.14,64.83 C14.1 | v22.86,56.9 IC7.4 | v22.86,60.71 IC7.1 24.77,60.77 24.77,62.61 25.4,63.25 C16.1 | C14.1 17.14,65.47 C15.2 20.32,66.74 20.64,67.06 R20.1 | C6.1 24.45,40.71 v24.13,40.39 24.13,37.85 24.45,37.53 R4.2 | IC8.4 31.18,47.43 v31.11,47.37 | C17.2 v38.73,59.44 | R6.2 v38.73,54.99 | IC6.7 45.19,64.62 v44.45,63.88 | IC5.12 IC5.13 v45.72,51.18 | 43.49,53.09 C12.2 v43.18,54.99 | IC6.12 53.98,70.23 v54.61,69.6 | IC4.9 v33.02,73.41 34.29,72.14 C10.1 | C8.2 15.55,73.09 v16.51,74.04 | D6.A 10.62,53.69 v10.62,54.08 10.62,53.7 D7.A | IC8.5 IC8.6 v33.66,40.39 | IC5.7 53.24,43.03 v53.34,42.93 | v42.42,48.9 41.07,48.9 41.05,48.87 C7.2 | IC4.7 24.23,71.4 v24.77,70.87 | R21.2 16.82,67.94 C14.1 | C11.2 36.83,80.9 v36.96,80.77 | C1.- 59.82,89.79 60.45,89.15 60.45,88.53 R30.1 | C25.2 v57.78,75.95 56.52,75.95 C34.2 | LED-PWR.C v27.62,85.79 | C13.2 55.63,72.26 v55.63,70.74 | C32.1 6.6,49.53 v6.6,50.8 | C4.1 7.37,61.91 v7.37,59.69 | IC12.3 57.78,29.34 v57.66,29.21 | IC13.3 59.5,13.97 57.66,13.97 v56.9,14.73 | U5.1 74.35,17.58 C42.2 74.29,17.53 v72.9,17.53 | C38.1 58.99,20.51 v58.93,20.57 59.25,20.89 C45.1
  Top 0.61: v71.75,70.87 73.03,70.87 73.66,70.23 C23.2 74.17,67.43 U4.1 | v71.75,58.8 73.03,58.8 73.66,58.17 C28.2 74.17,55.37 U1.1 | v71.75,48.64 73.03,48.64 73.66,48.01 C29.2 74.17,45.21 U2.1 | B1.- 73.03,84.84 74.17,83.7 C22.2 74.17,77.59 U3.1 | v71.88,35.81 C50.2 74.09,35.76 U8.1 | U6.1 73.28,7.11 C43.2 v69.6,8.89 | U7.1 74.35,26.37 C49.2 v75.69,26.67
  Top 0.813: B1.- 69.8,83.51 66.67,80.39 C4A.-
  Bottom 0.406: v24.77,70.87 26.04,70.23 | IC1.3 28.67,88.01 | 29.21,88.01 28.67,88.01 | 28.67,88.01 LED-PWR.C v27.62,85.79 | v6.6,50.8 v10.62,54.08 | v57.66,29.21 57.4,28.96 | v56.9,14.73 56.9,14.99 56.64,15.24 | v72.9,17.53 72.39,17.53 | v75.69,26.67 76.96,26.67 | v58.93,20.57 58.93,21.08
  Bottom 0.61: v71.88,35.81 71.12,35.81 | v69.6,8.89 69.09,8.89
  Bottom 1.27: 26.29,86.36 26.29,84.2
  Bottom 1.778: 30.23,85.98 30.23,84.07
  Bottom 2.54: 73.03,83.57 73.03,79.12 | 78.23,78.99 78.23,82.8
  pour Bottom (isolate 0.406): 0,93.09 0,-0.64 93.98,-0.64 93.98,93.09
IC5A_OUT  (via drill 0.6)
  Top 0.406: PHASE.3 56.52,56.26 56.52,54.36 57.78,53.09 57.78,48.01 55.88,46.1 55.88,41.27 53.34,38.73 v50.8,38.73 50.8,38.1 47.5,34.8 47.5,26.92 PHASE1.3 | v48.26,39.75 47.62,39.75 46.99,40.39 IC5.3
  Bottom 0.406: v48.26,39.75 49.78,39.75 v50.8,38.73
IC5B_OUT  (via drill 0.6)
  Top 0.406: PHASE.4 54.61,57.53 53.98,56.9 53.98,53.72 55.24,52.45 55.24,42.93 53.34,41.02 | IC5.6 50.8,41.66 51.44,41.02 53.34,41.02 | 53.34,41.02 v53.34,40.64
  Bottom 0.406: v53.34,40.64 53.34,31.24 52.32,30.23 52.32,28.19 PHASE1.4
N$1
  Top 0.406: PHASE1.1 51.05,29.21 52.32,27.94 52.32,25.65 PHASE1.6 | PHASE1.6 54.1,24.38 57.66,27.94 59.5,27.94 IC12.4 | PHASE1.6 55.24,22.73 55.24,14.61 57.15,12.7 59.5,12.7 IC13.4
N$2
  Top 0.61: R1.2 9.21,43.24 SV1.1 14.29,41.97 L1.4
N$3
  Top 0.305: RX1.6 6.38,79.76 | 14.5,81.1 14.61,81.2
  Top 0.406: 6.38,79.76 7.72,81.1 14.5,81.1 | IC4.1 22.86,79.76 20.64,81.98 15.24,81.98 14.61,81.34 14.61,81.2 R10.1
N$4
  Top 0.406: R16.1 30.16,65.47 R20.3
N$5  (via drill 0.6)
  Top 0.61: v65.41,82.93 v62.87,82.93
  Top 0.813: 69.8,89.23 B1.+ 69.8,87.83 65.41,83.44 v65.41,82.93
  Bottom 0.61: D15.1 61.21,82.93
  Bottom 0.813: v64.14,82.93 v62.87,82.93 61.21,82.93 60.83,82.93 57.66,86.11 55.37,86.11 C1.+ | v65.41,82.93 v64.14,82.93 | v64.14,82.93 IC3.1
N$6
  Top 0.406: R26.2 41.91,40.07 41.46,39.62 C33.1
N$7
  Top 0.406: LED-PWR.A 30.06,89.06 R25.1
N$8
  Top 0.406: 22.23,50.55 C5.1 22.23,50.87 22.23,53.09 R27.2
  Top 0.61: 6.99,47.87 6.99,48.01 9.65,48.01 | 6.99,47.87 6.99,41.66 9.21,39.43 SV1.2 | 9.65,48.01 11.75,48.01 13.02,46.74 19.68,46.74 22.23,49.28 22.23,50.23 C5.1 | U$7.2 6.99,47.87 | C32.2 9.65,49.53 9.65,48.01
N$9
  Top 0.61: SV1.3 14.29,36.89 L1.2
N$10
  Top 0.813: B1.AC1 83.89,89.93 U$2.2
N$11
  Top 0.406: IC4.2 21.77,78.49 D12.A
N$12  (via drill 0.6)
  Top 0.406: D12.C D13.C 17.96,80.39 v16.51,80.39 16.51,75.95 17.14,75.31 18.41,75.31 24.26,69.47 | v36.2,67.69 34.92,68.96 24.77,68.96 24.26,69.47 | IC6.3 43.81,70.23 43.18,69.6 43.18,68.96 39.37,65.15 39.37,64.52 v40.01,63.88 42.23,61.66 42.23,59.12 49.53,51.82 IC5.10 | R21.1 24.26,69.47 | R9.1 17.78,84.2 18.1,83.88 18.1,83.16 v18.06,83.12
  Bottom 0.406: v36.2,67.69 v40.01,63.88 | v18.06,83.12 16.51,81.57 v16.51,80.39
N$13
  Top 0.406: D13.A 18.41,76.58 21.59,73.41 IC4.6
N$14
  Top 0.406: IC4.5 IC4.4
N$15
  Top 0.406: IC10.7 66.04,67.06 66.67,67.69 66.67,74.99 | 66.67,74.99 66.67,77.85 68.58,79.76 72.39,79.76 73.03,79.12 73.03,77.22 73.79,76.45 U3.2 | 66.67,74.99 C18.1
N$17  (via drill 0.6)
  Top 0.406: v19.05,72.77 14.61,68.33 R11.1 15.17,66.8 13.21,66.8 13.21,66.42 v7.62,66.42 | IC4.3 22.23,77.22 21.59,76.58 v21.59,75.31
  Top 0.61: RX2.P$2 7.62,66.55 v7.62,66.42
  Bottom 0.406: v19.05,72.77 v21.59,75.31
N$18
  Top 0.406: R12.1 69.22,77.53 69.22,77.22 69.85,77.22 70.48,76.58 70.48,73.09 | 72.19,73.03 D8.A 71.25,73.09 70.48,73.09 | 70.48,73.09 C18.2 75.23,73.09 U3.5
N$19
  Top 1.016: C21.1 86.13,73.41 R19.1 86.13,75.31 U3.TAB
N$20
  Top 0.406: C20.1 68.26,64.52 | C20.1 67.94,68.96 68.58,69.6 72.39,69.6 73.03,68.96 73.03,67.06 73.79,66.29 U4.2 | IC10.5 67.63,64.52 C20.1
N$21
  Top 0.406: 70.48,62.93 71.25,62.93 D9.A 72.19,62.87 72.19,62.93 75.25,62.93 75.25,62.87 U4.5 | C20.2 70.48,62.93 | R18.1 69.53,67.37 70.48,66.42 70.48,62.93
N$22
  Top 0.813: U$3.1 86.44,60.66 U4.TAB
N$23  (via drill 0.6)
  Top 0.406: v57.15,64.52 IC10.4 59.69,64.46 59.69,55.63 59.05,54.99 | 59.05,54.99 PHASE.1 | IC9.4 57.78,42.29 56.52,43.56 56.52,45.47 59.05,48.01 59.05,54.99
  Bottom 0.406: v57.15,64.52 55.24,62.61 PHASE.6
N$24
  Top 1.016: C24.1 R19.2
N$25  (via drill 0.6)
  Top 0.406: PHASE.5 57.78,61.98 55.88,63.88 55.88,65.79 57.15,67.06 IC10.2 | PHASE.2 55.24,54.36 56.52,53.09 v56.52,48.2 | v57.72,44.83 IC9.2
  Bottom 0.406: PHASE.2 56.52,56.26 56.52,58.8 PHASE.5 | v57.72,44.83 57.72,46.04 56.52,47.37 v56.52,48.2
N$26
  Top 1.016: R24.1 91.44,55.31 C31.1
N$27
  Top 0.813: U$4.2 88.97,52.39 C30.2
  Top 1.016: 89.03,52.32 C30.2
  Top 1.422: C31.2 89.03,52.32
N$28
  Top 0.406: IC12.7 65.66,30.61 67.31,32.26 67.75,32.26 C39.1 72.2,32.19 72.64,31.75 73.97,31.75 U8.2
N$29
  Top 0.813: U$3.2 89.48,71.69 C21.2
  Top 1.422: C24.2 89.03,71.94 C21.2
N$30
  Top 0.305: IC11.5 57.53,78.93 C25.1
N$31
  Top 0.305: JP1.1 55.37,81.79 53.09,79.5 53.09,79.08 IC11.1
N$32
  Top 0.305: 58.17,83.82 58.17,85.09 59.44,86.36 60.39,86.36 R30.2 60.87,86.21 R29.3 | 58.17,83.82 58.17,81.79 56.13,79.76 54.61,79.76 54.36,79.5 54.36,78.49 53.85,77.98 IC11.2 51.82,77.98 51.56,77.72 51.56,75.95 52.32,75.18 C34.1 | TP2.TP 58.17,83.82
N$33
  Top 0.406: U8.5 D16.A 71.37,28.45 70.1,29.72 70.1,30.04 R32.1 69.85,30.29 C39.2
N$34
  Bottom 0.406: C35.1 R31.2
N$35
  Top 0.813: C41.1 89.25,31.73 R34.2 85.37,30.73 U8.TAB
N$36
  Top 0.406: 66.42,25.27 66.55,25.15 67.06,25.15 68.33,23.88 74.22,23.88 U7.2 | 66.42,25.27 64.83,26.86 IC12.5 | C40.1 66.11,24.96 66.42,25.27
N$37
  Top 0.406: U7.5 D17.A 71.12,20.57 70.1,21.59 70.1,22.16 R33.1 C40.2
N$38
  Top 0.813: U7.TAB 85.87,22.86 U$5.1
N$39
  Top 0.406: IC13.7 65.66,15.11 66.55,16 66.55,17.53 66.8,17.78 67.88,17.78 C46.1 68.9,17.97 72.9,13.97 74.22,13.97 U5.2
N$40
  Top 0.406: 74.09,10.41 U5.5 D18.A 72.06,11.76 69.85,13.97 68.26,13.97 R35.1 C46.2
N$41
  Top 0.406: IC5.2 45.72,45.47 48.26,45.47 | 48.26,45.47 IC5.4 | 48.26,45.47 52.07,45.47 53.98,47.37 53.98,51.18 50.48,54.67 50.48,61.02 53.34,63.88 53.34,65.79 52.7,66.42 IC6.9
N$42
  Top 0.813: C48.1 86.39,14.99 R37.1 83.06,14.96 U5.TAB
N$43
  Top 0.406: IC13.5 65.02,12.38 65.02,9.65 67.56,7.11 69.15,7.11 C47.1 71.44,7.3 72.39,6.35 72.39,6.1 72.64,5.84 73.97,5.84 U6.2
N$44
  Top 0.406: D19.A U6.5 72.64,2.54 71.44,3.74 R36.1 C47.2
N$45
  Top 0.813: U6.TAB 87.4,4.83 U$6.1
N$47  (via drill 0.6)  (1 unrouted)
  Top 0.406: IC12.2 59.5,30.48 57.15,30.48 56.13,29.46 PHASE1.2 53.59,32.26 v50.8,32.26 | v57.4,25.65 57.78,25.27 57.66,25.15 57.66,16 58.55,15.11 IC13.2
  Bottom 0.406: PHASE1.5 51.05,26.92 49.28,26.92 49.28,31.75 49.78,32.26 v50.8,32.26 | v57.4,25.65 57.4,26.16 54.1,29.46
N$48
  Top 0.813: U$5.2 90.54,25.01 91.95,26.42 91.95,28.06 C44.2 C41.2
N$49
  Top 0.813: U$6.2 90.8,8.5 91.69,9.4 91.69,11.81 C51.2 C48.2
N$50
  Top 0.813: R34.1 88.75,28.73 C44.1
N$51
  Top 0.813: R37.2 89,11.96 C51.1
N$53  (via drill 0.6)
  Top 0.406: IC7.7 C17.1 R15.1 35.24,63.57 41.27,69.6 41.27,72.14 41.91,72.77 IC6.1 46.99,72.77 v47.31,72.45 | v50.16,80.71 v50.17,80.71 52,80.71 JP1.2
  Bottom 0.406: v50.17,80.71 49.21,79.75 49.21,74.68 47.31,72.77 v47.31,72.45
N$54
  Top 0.406: IC4.12 34.11,77.22 D3.C 36.97,77.4 R13.1 37.78,77.22 44.45,77.22 48.9,72.77 48.9,68.96 50.16,67.69 IC6.10
N$57
  Top 0.406: IC4.11 32.84,75.95 D3.A 36.97,74.5 R13.2 37.15,74.68 C10.2
N$58  (via drill 0.6)
  Top 0.406: IC4.10 v32.38,74.68 | v32.38,78.49 33.02,79.12 40.01,79.12 41.27,77.85 45.09,77.85 49.53,73.41 49.53,72.14 50.16,71.5 IC6.13
  Bottom 0.406: v32.38,74.68 v32.38,78.49
N$59
  Top 0.406: IC7.5 IC7.6
N$60
  Top 0.406: R20.2 26.04,65.79 23.82,63.57 C15.1 TP1.TP 21.59,59.44 IC7.2
N$61
  Top 0.406: D4.C D5.C 18.59,57.71 19.05,58.17 | 19.05,58.17 IC7.3 | 19.05,58.17 17.78,59.44 R28.2 14.93,62.29 | 14.93,62.29 R17.2 | C14.2 14.93,62.29
N$69
  Top 0.813: B1.AC2 83.89,84.83 U$2.1
N$71
  Top 0.406: D5.A D7.C 13.52,56.9 3.37,56.9 U$8.2
N$72
  Top 0.406: D4.A D6.C 13.52,51.18 8.89,51.18 7.62,52.45 3.37,52.45 U$8.1
N$74  (via drill 0.6)
  Top 0.406: IC4.13 28.57,78.49 27.94,77.85 27.94,72.14 29.84,70.23 v37.47,70.23 | v42.55,65.15 43.18,64.52 43.18,59.44 52.07,50.55 IC5.8
  Bottom 0.406: v42.55,65.15 v37.47,70.23
N$76  (via drill 0.6)
  Top 0.406: v36.83,68.96 36.2,69.6 28.57,69.6 26.67,71.5 26.67,80.26 25.91,81.03 23.5,81.03 21.85,82.67 R14.2 | IC6.6 41.91,66.42 41.27,65.79 v41.27,64.52
  Bottom 0.406: v36.83,68.96 v41.27,64.52
N$77
  Top 0.406: C33.2 R7.1 39.05,44.2 35.56,44.2 34.92,43.56 IC8.7 34.92,40.07 37.78,37.21 47.62,37.21 49.53,39.12 IC5.5 49.53,44.83 52.7,44.83 54.61,46.74 54.61,51.82 51.44,54.99 51.44,60.71 54.61,63.88 54.61,67.69 53.34,68.96 IC6.11
N$78
  Top 0.406: R6.1 R5.2 34.92,52.13 IC8.2 34.92,46.1 35.56,45.47 38.1,45.47 38.73,46.1 39.05,46.1 R7.2 R26.1
N$80
  Top 0.406: R27.1 C5.2 R2.1
N$81
  Top 0.406: D2.A D1.C 28.89,47.87 R2.2 33.02,50.55 33.66,49.91 IC8.3
N$82
  Top 0.406: D1.A D2.C 26.99,42.93 C6.2 | C6.2 26.67,41.97 R4.1 R3.2 | C6.2 26.67,42.61
N$90
  Top 0.406: IC8.8 36.2,40.07 38.1,38.16 42.86,38.16 44.45,39.75 IC5.1
N$93
  Top 0.406: IC6.5 48.26,67.69 49.53,66.42 49.53,54.36 53.34,50.55 53.34,48.01 52.7,47.37 51.44,47.37 50.8,48.01 IC5.9
N$94
  Top 0.406: IC9.7 66.04,44.83 66.67,45.47 66.67,52.77 | 66.67,52.77 66.67,55.63 68.58,57.53 72.39,57.53 73.03,56.9 73.03,54.99 73.79,54.23 U1.2 | 66.67,52.77 C26.1
N$95
  Top 0.406: D10.A 72.16,50.14 | D10.A 72.19,50.81 | C26.2 70.48,50.87 | 70.48,50.87 71.25,50.87 D10.A | R22.1 69.53,55.31 70.48,54.36 70.48,50.87 | U1.5 71.75,50.81 D10.A
N$96
  Top 1.016: C30.1 86.23,53.09 U1.TAB | 86.23,55.31 R24.2
  Top 1.422: 86.23,55.31 C30.1
N$97
  Top 0.406: IC9.5 68.27,42.29 C27.1 67.94,46.74 68.58,47.37 72.39,47.37 73.03,46.74 73.03,44.83 73.79,44.07 U2.2
N$98
  Top 0.406: R23.1 69.22,45.15 69.53,45.15 70.48,44.2 70.48,40.71 | C27.2 70.48,40.71 | 70.48,40.71 71.25,40.71 D11.A 72.19,40.65 U2.5
N$99
  Top 0.813: U$4.1 83.52,41.35 U2.TAB
N$102
  Top 0.406: R8.1 24.13,82.04 23.43,82.74 23.43,89.22 LED.6
N$103
  Top 0.406: R14.1 18.44,85.66 18.44,89.26 LED.4
N$104
  Top 0.406: LED.2 13.34,85.23 R9.2

### Text on the board
Top: *
Bottom: Steve Ward / Eric Goodchild / Gao Guangyan
tNames: - | + | + | - | + | 220u / 35V | 50k | 330u / 25V | 19-26.5VAC | -SIG OCD PWR+ | 330u / 25V | - | # | R7809 | ~ | 220u / 35V | # | 74HC14 | OPF2412T | o | 74HC74 | 27423 | RX2 | # | IFD95T/C | LM311 | 220u / 35V | 51R | 74HC08 | o | TL3116 | 27423 | R | Slot-7 | * | IN : OUT | LR | www.loneoceans.com/labs/ | UNIVERSAL DRSSTC DRIVER | V2.7 REV C 2014
bNames: + SIG - | + OCD - | + PWR - | R17 | OCD (extra) | Optional | 35VDC
tStop: *
bStop: Steve Ward / Eric Goodchild / Gao Guangyan